# EAGLE design esp-module-su (EAGLE 9.6.2)
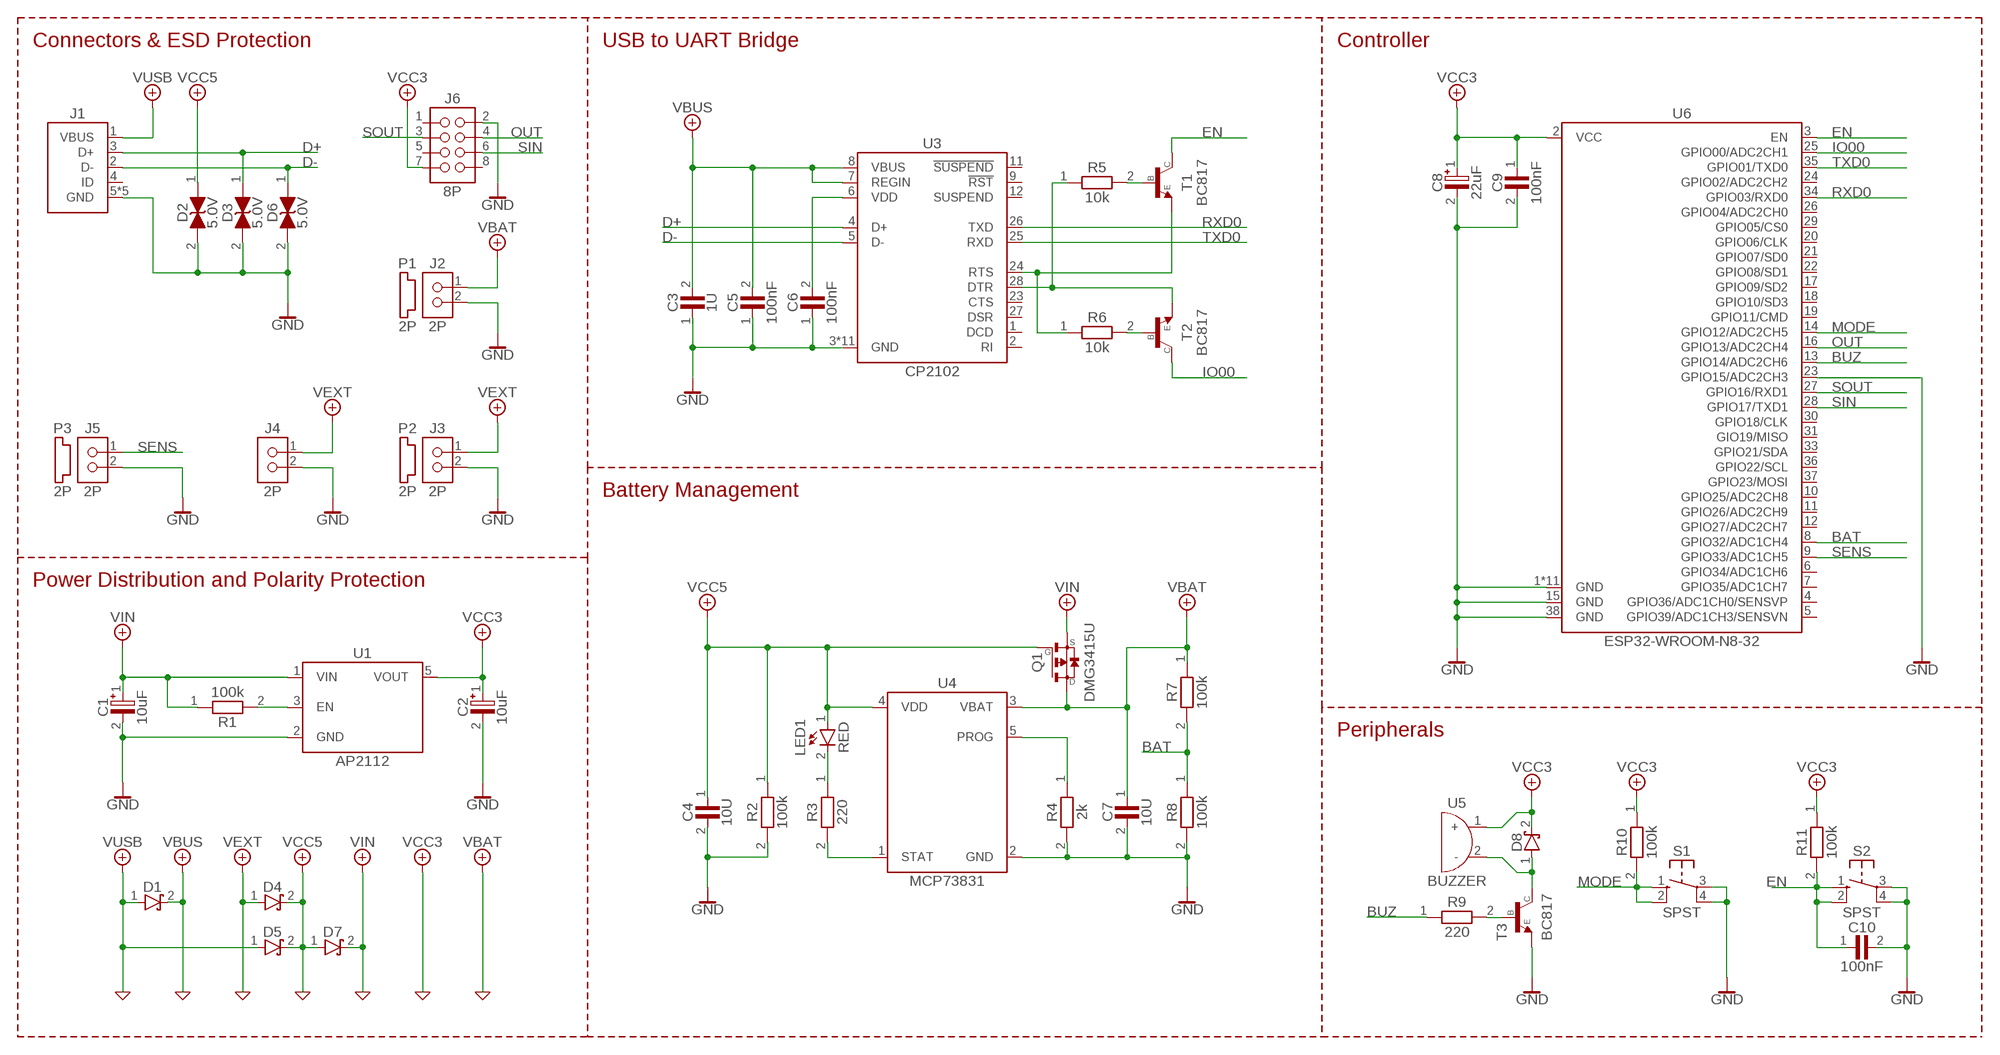
[diagram p0: schematic, sheet 1]

## Parts
C1  10uF  CAPACITOR-TANTALUM-10U-I1206-M3216  [I1206-M3216-D]
C2  10uF  CAPACITOR-TANTALUM-10U-I1206-M3216  [I1206-M3216-D]
C3  1U  CAPACITOR-CERAMIC-1U-I0805-M2012  [I0805-M2012-C]
C4  10U  CAPACITOR-CERAMIC-10U-I0805-M2012  [I0805-M2012-C]
C5  100nF  CAPACITOR-CERAMIC-100N-I0805-M2012  [I0805-M2012-C]
C6  100nF  CAPACITOR-CERAMIC-100N-I0805-M2012  [I0805-M2012-C]
C7  10U  CAPACITOR-CERAMIC-10U-I0805-M2012  [I0805-M2012-C]
C8  22uF  CAPACITOR-TANTALUM-22U-I1206-M3216  [I1206-M3216-D]
C9  100nF  CAPACITOR-CERAMIC-100N-I0805-M2012  [I0805-M2012-C]
C10  100nF  CAPACITOR-CERAMIC-100N-I0805-M2012  [I0805-M2012-C]
D1  30V  SCHOTTKY-30V-SOD-323  [SOD-323]
D2  5.0V  ZENER-BI-5.0V-SOD-523  [SOD-523]
D3  5.0V  ZENER-BI-5.0V-SOD-523  [SOD-523]
D4  30V  SCHOTTKY-30V-SOD-323  [SOD-323]
D5  30V  SCHOTTKY-30V-SOD-323  [SOD-323]
D6  5.0V  ZENER-BI-5.0V-SOD-523  [SOD-523]
D7  30V  SCHOTTKY-30V-SOD-323  [SOD-323]
D8  30V  SCHOTTKY-30V-SOD-323  [SOD-323]
J1  USB-A-MICRO-SMD-SIDE  [USB-A-MICRO-SMD-SIDE]
J2  2P  HEADER-02P-1R-S2B-PH-SM4-TB  [JST-S2B-PH-SM4-TB]
J3  2P  HEADER-02P-1R-S2B-PH-SM4-TB  [JST-S2B-PH-SM4-TB]
J4  2P  HEADER-02P-1R-PZ254V-11-02P  [PZ254V-11-02P]
J5  2P  HEADER-02P-1R-S2B-PH-SM4-TB  [JST-S2B-PH-SM4-TB]
J6  8P  HEADER-08P-2R-PM254V-12-08-H85  [PM254V-12-08-H85]
LED1  RED  LED-RED-I0805-M2012  [I0805-M2012-D]
P1  2P  CONNECTOR-02P-1R-PHR  [CONNECTOR-DEFAULT]
P2  2P  CONNECTOR-02P-1R-PHR  [CONNECTOR-DEFAULT]
P3  2P  CONNECTOR-02P-1R-PHR  [CONNECTOR-DEFAULT]
Q1  DMG3415U  MOSFET-P-CHANNEL-20V-4A-SOT-23-3  [SOT-23-3]
R1  100k  RESISTOR-100K-I0805-M2012  [I0805-M2012-R]
R2  100k  RESISTOR-100K-I0805-M2012  [I0805-M2012-R]
R3  220  RESISTOR-220-I0805-M2012  [I0805-M2012-R]
R4  2k  RESISTOR-2K-I0805-M2012  [I0805-M2012-R]
R5  10k  RESISTOR-10K-I0805-M2012  [I0805-M2012-R]
R6  10k  RESISTOR-10K-I0805-M2012  [I0805-M2012-R]
R7  100k  RESISTOR-100K-I0805-M2012  [I0805-M2012-R]
R8  100k  RESISTOR-100K-I0805-M2012  [I0805-M2012-R]
R9  220  RESISTOR-220-I0805-M2012  [I0805-M2012-R]
R10  100k  RESISTOR-100K-I0805-M2012  [I0805-M2012-R]
R11  100k  RESISTOR-100K-I0805-M2012  [I0805-M2012-R]
S1  SPST  SWITCH-12V-50MA  [SMD-SW-4]
S2  SPST  SWITCH-12V-50MA  [SMD-SW-4]
T1  BC817  TRANSISTOR-NPN-SOT-23-3  [SOT-23-3]
T2  BC817  TRANSISTOR-NPN-SOT-23-3  [SOT-23-3]
T3  BC817  TRANSISTOR-NPN-SOT-23-3  [SOT-23-3]
U1  AP2112  AP2112-SOT-25-5  [SOT-25-5]
U3  CP2102  CP2102-QFN-28  [QFN-28]
U4  MCP73831  MCP73831-SOT-23-5  [SOT-23-5]
U5  BUZZER  [SMD-BUZZER]
U6  ESP32-WROOM-N8-32  [ESP32-WROOM-32]

## Nets
ABEN: R1.2 U1.3(EN)
BAT: R7.2 R8.1 U6.8(GPIO32/ADC1CH4)
BUZ: R9.1 U6.13(GPIO14/ADC2CH6)
BZB: R9.2 T3.1(B)
BZC: D8.1(A) T3.3(C) U5.2(-)
D+: D3.1(A) J1.3(D+) U3.4(D+)
D-: D6.1(A) J1.2(D-) U3.5(D-)
DTR1: R5.1 T2.2(E) U3.28(DTR)
DTRT1: R5.2 T1.1(B)
EN: C10.1 R11.2 S2.1 S2.2 T1.3(C) U6.3(EN)
GND: C1.2(-) C2.2(-) C3.1 C4.2 C5.1 C6.1 C7.2 C8.2(-) C9.2 C10.2 D2.2(C) D3.2(C) D6.2(C) J1.5(GND) J1.6(GND) J1.7(GND) J1.8(GND) J1.9(GND) J2.2 J3.2 J4.2 J5.2 J6.2 R2.2 R4.2 R8.2 S1.3 S1.4 S2.3 S2.4 T3.2(E) U1.2(GND) U3.3(GND) U3.29(GND) U3.30(GND) U3.31(GND) U3.32(GND) U3.33(GND) U3.34(GND) U3.35(GND) U3.36(GND) U3.37(GND) U3.38(GND) U4.2(GND) U6.1(GND) U6.15(GND) U6.23(GPIO15/ADC2CH3) U6.38(GND) U6.39(GND) U6.40(GND) U6.41(GND) U6.42(GND) U6.43(GND) U6.44(GND) U6.45(GND) U6.46(GND) U6.47(GND) U6.48(GND)
IO00: T2.3(C) U6.25(GPIO00/ADC2CH1)
MODE: R10.2 S1.1 S1.2 U6.14(GPIO12/ADC2CH5)
OUT: J6.4 U6.16(GPIO13/ADC2CH4)
PROG1: R4.1 U4.5(PROG)
RTS1: R6.1 T1.2(E) U3.24(RTS)
RTST1: R6.2 T2.1(B)
RXD0: U3.26(TXD) U6.34(GPIO03/RXD0)
SENS: J5.1 U6.9(GPIO33/ADC1CH5)
SIN: J6.6 U6.28(GPIO17/TXD1)
SOUT: J6.3 U6.27(GPIO16/RXD1)
STAT1: R3.2 U4.1(STAT)
STATLED1: LED1.2(C) R3.1
TXD0: U3.25(RXD) U6.35(GPIO01/TXD0)
VBAT: C7.1 J2.1 Q1.3(D) R7.1 U4.3(VBAT)
VBUS: C3.2 C5.2 D1.2(C) U3.7(REGIN) U3.8(VBUS)
VCC3: C2.1(+) C8.1(+) C9.1 D8.2(C) J6.7 R10.1 R11.1 U1.5(VOUT) U5.1(+) U6.2(VCC)
VCC5: C4.1 D2.1(A) D4.2(C) D5.2(C) D7.1(A) LED1.1(A) Q1.1(G) R2.1 U4.4(VDD)
VDD: C6.2 U3.6(VDD)
VEXT: D4.1(A) J3.1 J4.1
VIN: C1.1(+) D7.2(C) Q1.2(S) R1.1 U1.1(VIN)
VUSB: D1.1(A) D5.1(A) J1.1(VBUS)
Unconnected: J1.4(ID) J6.1 J6.5 J6.8 U3.1(DCD) U3.2(RI) U3.9(!RST) U3.11(!SUSPEND) U3.12(SUSPEND) U3.23(CTS) U3.27(DSR) U6.4(GPIO36/ADC1CH0/SENSVP) U6.5(GPIO39/ADC1CH3/SENSVN) U6.6(GPIO34/ADC1CH6) U6.7(GPIO35/ADC1CH7) U6.10(GPIO25/ADC2CH8) U6.11(GPIO26/ADC2CH9) U6.12(GPIO27/ADC2CH7) U6.17(GPIO09/SD2) U6.18(GPIO10/SD3) U6.19(GPIO11/CMD) U6.20(GPIO06/CLK) U6.21(GPIO07/SD0) U6.22(GPIO08/SD1) U6.24(GPIO02/ADC2CH2) U6.26(GPIO04/ADC2CH0) U6.29(GPIO05/CS0) U6.30(GPIO18/CLK) U6.31(GIO19/MISO) U6.33(GPIO21/SDA) U6.36(GPIO22/SCL) U6.37(GPIO23/MOSI)

## Notes on the sheet
- Connectors & ESD Protection | USB to UART Bridge | Controller
- Battery Management
- Power Distribution and Polarity Protection
- Peripherals

## Library data of the parts
C1 C2 = deiring-components:CAPACITOR-TANTALUM: Capacitors Tantalum; LCSC: C7171; MF: Kyocera AVX; MPN: TAJA106K016RNJ; VOLTAGE: 16V
C3 = deiring-components:CAPACITOR-CERAMIC: Capacitors Multilayer Ceramic; LCSC: C215803; MF: FH (Guangdong Fenghua Advanced Tech); MPN: 0805B105K500NT; TOLERANCE: 10%; VOLTAGE: 50V
C4 C7 = deiring-components:CAPACITOR-CERAMIC: Capacitors Multilayer Ceramic; LCSC: C15850; MF: Samsung Electro-Mechanics; MPN: CL21A106KAYNNNE; TOLERANCE: 10%; VOLTAGE: 25V
C5 C6 C9 C10 = deiring-components:CAPACITOR-CERAMIC: Capacitors Multilayer Ceramic; LCSC: C38141; MF: FH (Guangdong Fenghua Advanced Tech); MPN: 0805B104K500NT; TOLERANCE: 10%; VOLTAGE: 50V
C8 = deiring-components:CAPACITOR-TANTALUM: Capacitors Tantalum; LCSC: C11366; MF: Kyocera AVX; MPN: TAJA226K010RNJ; VOLTAGE: 10V
D1 D4 D5 D7 D8 = deiring-components:SCHOTTKY: Shottky Barrier Diodes; LCSC: C124187; MF: Diodes Incorporated; MPN: BAT760-7
D2 D3 D6 = deiring-components:ZENER-BI: Zener Diode; LCSC: C383211; MF: LRC; MPN: LESD5D5.0CT1G
J1 = deiring-components:USB-A: USB Micro-B Connector; LCSC: C381143; MF: XKB Connectivity; MPN: U254-051T-4BHJ25-F2S
J2 J3 J5 = deiring-components:HEADER-02P-1R: Header 2 Pin 1 Row; LCSC: C295747; MF: JST Sales America; MPN: S2B-PH-SM4-TB(LF)(SN)
J4 = deiring-components:HEADER-02P-1R: Header 2 Pin 1 Row; LCSC: C492401; MF: XFCN; MPN: PZ254V-11-02P
J6 = deiring-components:HEADER-08P-2R: Header 8 Pin 2 Row; LCSC: C2834799; MF: XFCN; MPN: PM254V-12-08-H85
LED1 = deiring-components:LED: Light Emitting Diodes; LCSC: C84256; MF: Foshan NationStar Optoelectronics; MPN: FC-2012HRK-620D
P1-P3 = deiring-components:CONNECTOR-02P-1R: Plug 2 Pin 1 Row; LCSC: C3195190; MF: JST Sales America; MPN: PHR-2
Q1 = deiring-components:MOSFET-P-CHANNEL: P-Channel MOSFET; CURRENT: 4A; LCSC: C96616; MF: Diodes Incorporated; MPN: DMG3415U-7; VOLTAGE: 20V
R1 R2 R7 R8 R10 R11 = deiring-components:RESISTOR: Chip Resistor; LCSC: C149504; MF: UNI-ROYAL(Uniroyal Elec); MPN: 0805W8F1003T5E; WATTAGE: 1/8W
R3 R9 = deiring-components:RESISTOR: Chip Resistor; LCSC: C17557; MF: UNI-ROYAL(Uniroyal Elec); MPN: 0805W8F2200T5E; WATTAGE: 1/8W
R4 = deiring-components:RESISTOR: Chip Resistor; LCSC: C17604; MF: UNI-ROYAL(Uniroyal Elec); MPN: 0805W8F2001T5E; WATTAGE: 1/8W
R5 R6 = deiring-components:RESISTOR: Chip Resistor; LCSC: C17414; MF: UNI-ROYAL(Uniroyal Elec); MPN: 0805W8F1002T5E; WATTAGE: 1/8W
S1 S2 = deiring-components:SWITCH: Tactile Switch SPST; LCSC: C318884; MF: XKB Enterprise; MPN: TS-1187A-B-A-B; VOLTAGE: 12V
T1-T3 = deiring-components:TRANSISTOR-NPN: NPN General-Ourpose Transistors; LCSC: C52801; MF: Nexperia; MPN: BC817-40,215
U1 = deiring-components:AP2112: Linear Voltage Regulators; LCSC: C3021085; MF: TECH PUBLIC; MPN: TPAP2112K-3.3TRG1
U3 = deiring-components:CP2102: Single-Chip USB to UART Bridge; LCSC: C6568; MF: SILICON LABS; MPN: CP2102-GMR
U4 = deiring-components:MCP73831: Miniature Single-Cell, Fully Integrated Li-Ion, Li-Polymer Charge Management Controllers; LCSC: C14879; MF: Microchip Tech; MPN: MCP73831T-2ATI/OT
U5 = deiring-components:BUZZER: Externally Driven Buzzer; LCSC: C95299; MF: MLT-7525; MPN: Jiangsu Huaneng Elec
U6 = deiring-components:ESP32-WROOM: ESP WROOM 32; LCSC: C529582; MF: Espressif Systems; MPN: ESP32-WROOM-32-N8; VALUES: ESP32

## Board
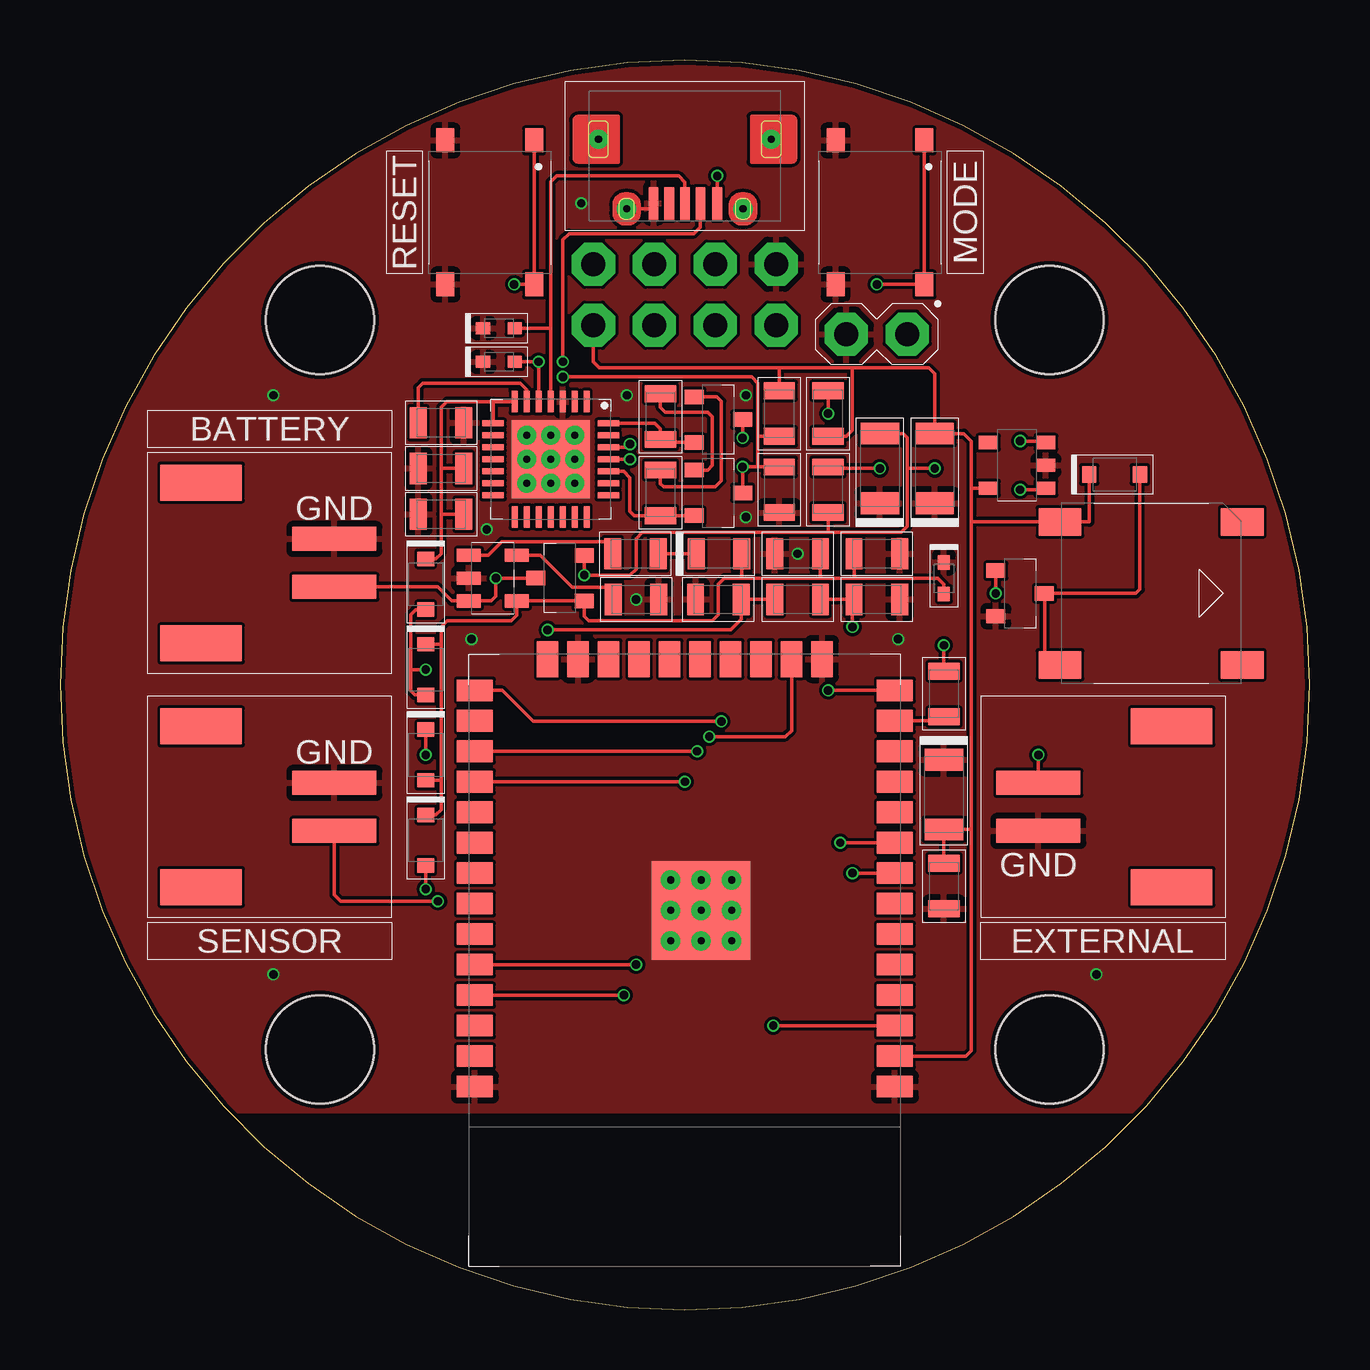
[diagram p1: board, top side]
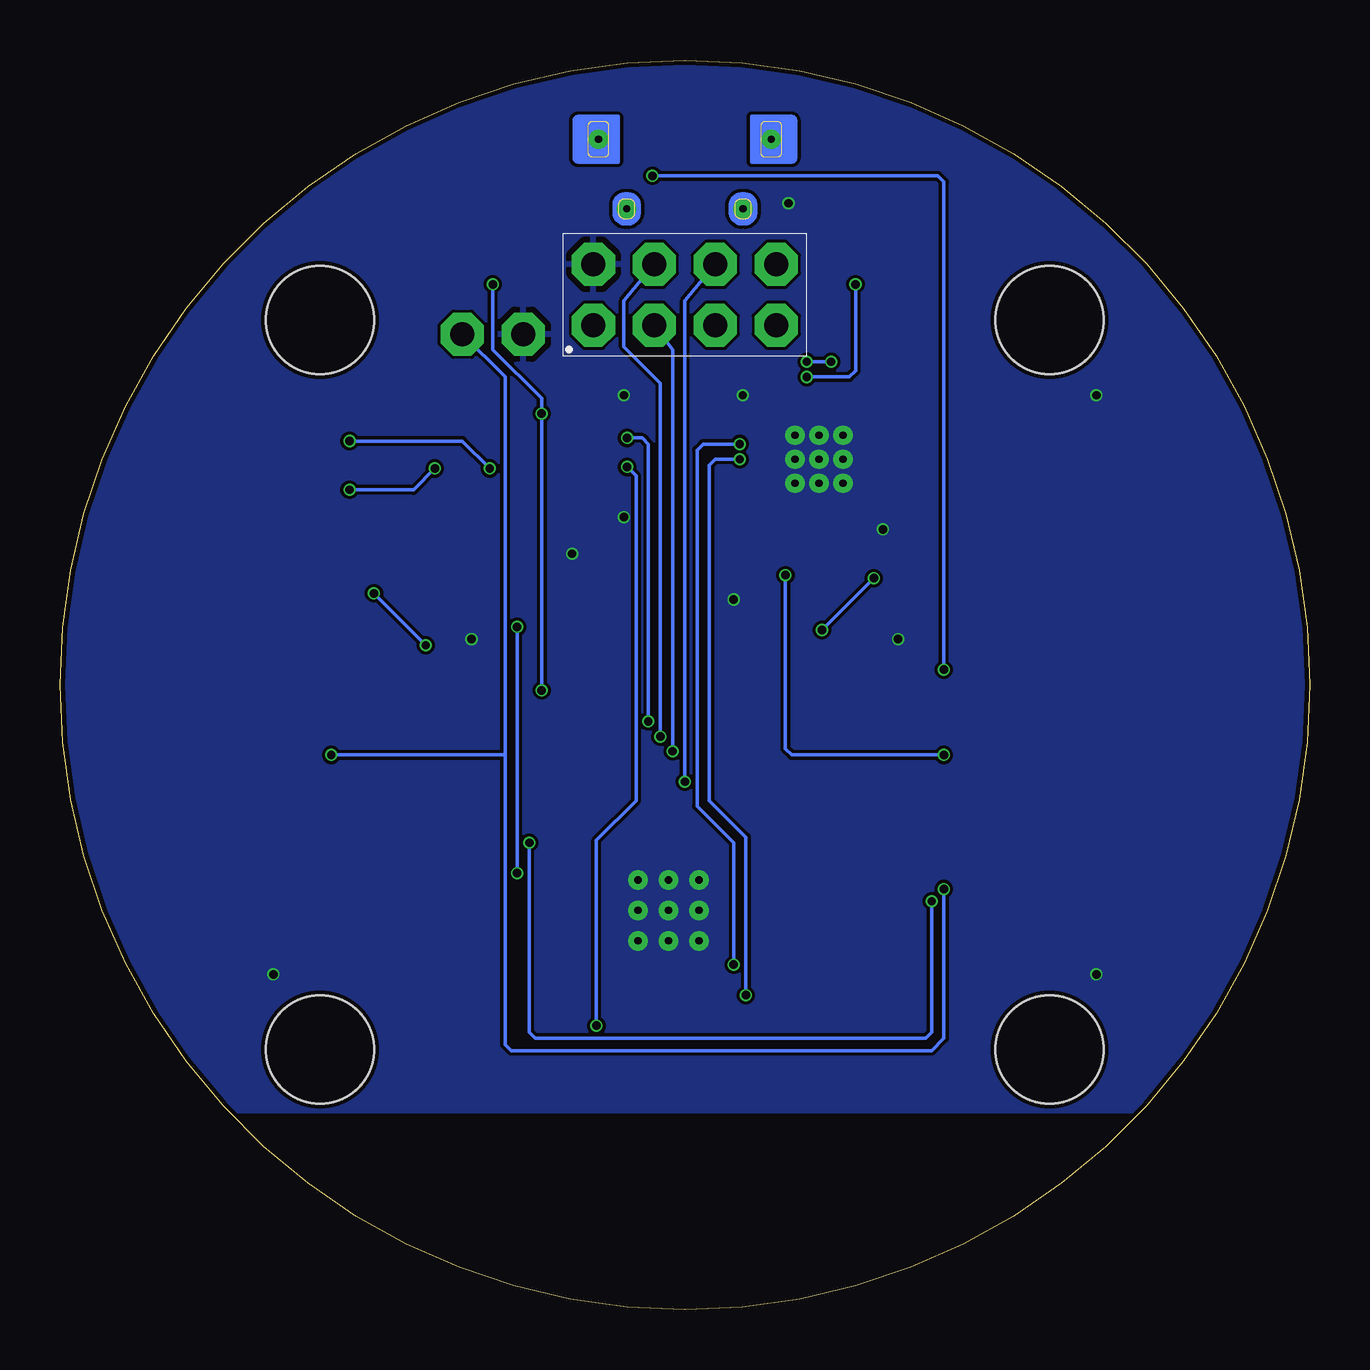
[diagram p2: board, bottom side, seen from below]

Size 52.07 x 52.07 mm. Coordinates in mm from the lower left corner, seen from the top.
Outline: 52.07,26.04 arc90 26.04,52.07 arc90 0,26.04 arc90 26.04,0 arc90 52.07,26.04
Copper layers (1*16): Top 0.035mm / dielectric 1.6mm / Bottom 0.035mm
Design rules "jlcpcb-2layers": minimum track width 5mil, minimum drill 0.3mm, track to track 5mil, track to pad 5mil, pad to pad 5mil, via to via 5mil, smd to smd 5mil, copper to edge 0.2mm, drill to drill 6mil, minimum pad ring 10mil, minimum via ring 3mil, stop-mask expansion 4mil, vias tented up to drill 0mil, thermal gap 10mil
Holes 4.5 mm at 41.23,41.23 10.84,41.23 10.84,10.84 41.23,10.84

### Footprints (pad centres in the part's own frame; a part is rotated, then mirrored left to right if it is on the bottom)
I1206-M3216-D = smd 0.9 x 1.6: 1 -1.45,0; 2 1.45,0
I0805-M2012-C = smd 0.7 x 1.3: 1 -0.95,0; 2 0.95,0
SOD-323 = smd 0.6 x 0.7: 1 -1.055,0; 2 1.055,0
SOD-523 = smd 0.6 x 0.5: 1 -0.66,0; 2 0.66,0
USB-A-MICRO-SMD-SIDE = smd 0.4 x 1.35: 1 -1.35,2.675; 2 -0.65,2.675; 3 0,2.675; 4 0.65,2.675; 5 1.3,2.675 | drill 0.3 pad 0.6: 6 -2.425,2.9; 7 2.425,2.9 | drill 0.3: 8 -3.6,0; 9 3.6,0
JST-S2B-PH-SM4-TB = smd 1 x 3.5: 1 -1,0; 2 1,0 | smd 1.5 x 3.4: A -3.35,5.55; B 3.35,5.55
PZ254V-11-02P = drill 1 pad 1.7 octagon: 1 -1.27,0; 2 1.27,0
PM254V-12-08-H85 = drill 1 pad 1.7 octagon: 1 -3.81,-1.27; 2 -3.81,1.27; 3 -1.27,-1.27; 4 -1.27,1.27; 5 1.27,-1.27; 6 1.27,1.27; 7 3.81,-1.27; 8 3.81,1.27
I0805-M2012-D = smd 0.7 x 1.3: 1 -0.95,0; 2 0.95,0
SOT-23-3 = smd 0.8 x 0.6: 1 1.01,-0.95; 2 1.01,0.95; 3 -1.01,0
I0805-M2012-R = smd 0.7 x 1.3: 1 -0.95,0; 2 0.95,0
SMD-SW-4 = smd 1 x 0.75: 1 -3,1.85; 2 3,1.85; 3 -3,-1.85; 4 3,-1.85
SOT-25-5 = smd 0.55 x 0.8: 1 0.95,1.2; 2 0,1.2; 3 -0.95,1.2; 4 -0.95,-1.2; 5 0.95,-1.2
QFN-28 = smd 0.9 x 0.25: 1 -2.4,1.5; 2 -2.4,1; 3 -2.4,0.5; 4 -2.4,0; 5 -2.4,-0.5; 6 -2.4,-1; 7 -2.4,-1.5; 15 2.4,-1.5; 16 2.4,-1; 17 2.4,-0.5; 18 2.4,0; 19 2.4,0.5; 20 2.4,1; 21 2.4,1.5 | smd 0.25 x 0.9: 8 -1.5,-2.4; 9 -1,-2.4; 10 -0.5,-2.4; 11 0,-2.4; 12 0.5,-2.4; 13 1,-2.4; 14 1.5,-2.4; 22 1.5,2.4; 23 1,2.4; 24 0.5,2.4; 25 0,2.4; 26 -0.5,2.4; 27 -1,2.4; 28 -1.5,2.4 | smd 3.25 x 3.25: 29 0,0 | drill 0.3 pad 0.5: 30 -1,1; 31 0,1; 32 1,1; 33 -1,0; 34 0,0; 35 1,0; 36 -1,-1; 37 0,-1; 38 1,-1
SOT-23-5 = smd 1 x 0.55: 1 -1,0.95; 2 -1,0; 3 -1,-0.95; 4 1,-0.95; 5 1,0.95
SMD-BUZZER = smd 1.78 x 1.15: 1 -3.795,2.98; 2 -3.795,-2.98; 3 3.795,-2.98; 4 3.795,2.98
ESP32-WROOM-32 = smd 1.5 x 0.9: 1 -8.75,7.34; 2 -8.75,6.07; 3 -8.75,4.8; 4 -8.75,3.53; 5 -8.75,2.26; 6 -8.75,0.99; 7 -8.75,-0.28; 8 -8.75,-1.55; 9 -8.75,-2.82; 10 -8.75,-4.09; 11 -8.75,-5.36; 12 -8.75,-6.63; 13 -8.75,-7.9; 14 -8.75,-9.17; 25 8.75,-9.17; 26 8.75,-7.9; 27 8.75,-6.63; 28 8.75,-5.36; 29 8.75,-4.09; 30 8.75,-2.82; 31 8.75,-1.55; 32 8.75,-0.28; 33 8.75,0.99; 34 8.75,2.26; 35 8.75,3.53; 36 8.75,4.8; 37 8.75,6.07; 38 8.75,7.34 | smd 0.9 x 1.5: 15 -5.715,-10.47; 16 -4.445,-10.47; 17 -3.175,-10.47; 18 -1.905,-10.47; 19 -0.635,-10.47; 20 0.635,-10.47; 21 1.905,-10.47; 22 3.175,-10.47; 23 4.445,-10.47; 24 5.715,-10.47 | smd 4.1 x 4.1: 39 -0.68,0 | drill 0.3 pad 0.5: 40 0.59,-1.27; 41 -0.68,-1.27; 42 -1.95,-1.27; 43 0.59,0; 44 -0.68,0; 45 -1.95,0; 46 0.59,1.27; 47 -0.68,1.27; 48 -1.95,1.27

### Placement (x,y rotation side)
C1  34.16,35.05 270 top
C2  36.45,35.05 270 top
C3  15.88,35.05 0 top
C4  30.73,31.5 180 top
C5  15.88,33.15 0 top
C6  15.88,36.96 180 top
C7  27.43,29.59 180 top
C8  36.83,21.46 90 top
C9  36.83,17.65 270 top
C10  29.97,34.16 270 top
D1  15.24,30.23 90 top
D2  36.83,30.48 90 top
D3  18.29,40.89 180 top
D4  15.24,19.56 90 top
D5  15.24,26.67 90 top
D6  18.29,39.5 180 top
D7  15.24,23.11 90 top
D8  43.94,34.8 180 top
J1  26.04,48.77 180 top
J2  11.43,31.11 90 top
J3  40.77,20.95 270 top
J4  34.04,40.64 180 top
J5  11.43,20.95 90 top
J6  26.04,42.29 0 bottom
LED1  27.46,31.5 180 top
P1  6.48,31.11 90 top
P2  45.34,20.95 90 top
P3  6.48,20.95 90 top
Q1  20.83,30.48 0 top
R1  32,34.16 90 top
R2  34.04,31.5 0 top
R3  23.98,31.5 180 top
R4  24,29.59 0 top
R5  25.02,37.21 90 top
R6  25.02,34.04 90 top
R7  30.73,29.59 0 top
R8  34.04,29.59 0 top
R9  36.83,25.65 90 top
R10  32,37.34 90 top
R11  29.97,37.34 270 top
S1  34.16,45.72 270 top
S2  17.91,45.72 270 top
T1  27.43,34.04 180 top
T2  27.43,37.08 180 top
T3  40.01,29.84 180 top
U1  39.88,35.18 270 top
U3  20.45,35.43 270 top
U4  18.03,30.48 0 top
U5  45.47,29.84 0 top
U6  26.04,16.64 180 top

### Tracks (layer width: path | path; a pad name or v marks a point on that pad's centre or on a via)
ABEN  (via drill 0.35)
  Top 0.152: v34.16,35.05 32,35.05 R1.2 | v40.01,36.2 41.08,36.2 U1.3
  Bottom 0.152: v34.16,35.05 35.31,36.2 v40.01,36.2
BAT  (via drill 0.35)
  Top 0.152: R7.2 R8.1 33.02,29.59 v33.02,28.45 | v33.02,18.19 U6.8
  Bottom 0.152: v33.02,18.19 v33.02,28.45
BUZ
  Top 0.152: U6.13 36.83,24.54 R9.1
BZB  (via drill 0.35)
  Top 0.152: T3.1 v38.99,29.84 | R9.2 v36.83,27.69
  Bottom 0.152: v36.83,27.69 v38.99,29.84
BZC
  Top 0.152: T3.3 | T3.3 44.83,29.84 45,30.01 D8.1 | U5.2 41.02,26.86 T3.3
D+
  Top 0.152: J1.3 26.04,46.98 25.77,47.24 20.7,47.24 20.45,46.99 20.45,40.89 | U3.4 20.45,40.89 | 20.45,40.89 D3.1
D-  (via drill 0.35)
  Top 0.152: U3.5 v19.95,39.5 v19.94,39.5 D6.1 | v20.95,39.5 20.95,44.58 21.21,44.83 26.42,44.83 26.68,45.1 J1.2
  Bottom 0.152: v19.94,39.5 v20.95,39.5
DTR1
  Top 0.152: U3.28 24.79,36.93 25.02,36.7 R5.1 25.02,36.13 T2.2
DTRT1
  Top 0.152: R5.2 25.02,37.59 25.21,37.4 26.99,37.4 27.18,37.21 27.18,35.18 26.98,34.99 T1.1
EN  (via drill 0.35)
  Top 0.152: S2.1 S2.2 v18.92,42.72 | U6.3 v29.72,11.84 | 29.08,35.11 v28.44,35.11 T1.3 | 29.08,35.11 C10.1 | v20.95,38.86 28.83,38.86 29.08,38.61 29.08,36.58 29.08,36.39 | 29.08,36.39 29.08,35.11 | R11.2 29.08,36.39
  Bottom 0.152: v29.72,11.84 29.72,19.56 28.07,21.21 28.07,34.74 v28.44,35.11 | v20.95,38.86 19.18,38.86 18.92,39.12 v18.92,42.72
GND  (via drill 0.35)
  Top 0.152: J1.7 24.73,45.87 J1.5
  other vias: 24,29.59 34.92,27.94 30.73,31.5 8.89,38.1 43.18,13.97 8.89,13.97 17.14,27.94 28.57,33.02 28.57,38.1 23.62,38.1 17.78,32.51 21.72,46.1
  pour Top (isolate 0.076): -1.27,8.26 53.34,8.26 53.34,53.34 -1.27,53.34
  pour Bottom: -2.54,8.26 54.61,8.26 54.61,54.61 -2.54,54.61
IO00  (via drill 0.35)
  Top 0.152: U6.25 18.43,25.81 19.72,24.51 v27.56,24.51 | T2.3 v28.44,36.32
  Bottom 0.152: v27.56,24.51 27.56,36.07 27.81,36.32 v28.44,36.32
MODE  (via drill 0.35)
  Top 0.152: S1.1 S1.2 v34.04,42.72 | v32,25.81 U6.14 | R10.2 v32,37.34
  Bottom 0.152: v32,25.81 v32,37.34 32,37.97 34.04,40.01 v34.04,42.72
OUT  (via drill 0.35)
  Top 0.152: v27.05,23.88 30.23,23.88 30.48,24.13 U6.16
  Bottom 0.152: v27.05,23.88 27.05,38.61 28.57,40.13 28.57,42.04 J6.4
PROG1
  Top 0.152: U4.5 20,31.43 21.34,30.1 23.05,30.1 R4.1
RTS1
  Top 0.152: T1.2 R6.1 23.94,33.09 23.75,33.27 23.75,34.67 23.49,34.93 U3.24
RTST1
  Top 0.152: R6.2 25.02,34.42 25.15,34.29 27.3,34.29 27.56,34.54 27.56,37.85 27.37,38.03 T2.1
RXD0  (via drill 0.35)
  Top 0.152: U6.34 v24,14.38 | U3.26 23.61,35.93 v23.75,36.07
  Bottom 0.152: v23.75,36.07 25.27,36.07 25.53,35.81 25.53,20.98 24,19.46 v24,14.38
SENS  (via drill 0.35)
  Top 0.152: v15.75,17.02 11.7,17.02 11.43,17.29 J5.1 | v32.51,19.46 U6.9
  Bottom 0.152: v32.51,19.46 32.51,11.56 32.26,11.3 16,11.3 15.75,11.56 v15.75,17.02
SIN  (via drill 0.35)
  Top 0.152: v26.04,22 U6.28
  Bottom 0.152: J6.6 26.04,42.04 v26.04,22
SOUT  (via drill 0.35)
  Top 0.152: v26.54,23.27 U6.27
  Bottom 0.152: J6.3 26.54,40.01 v26.54,23.27
STAT1
  Top 0.152: U4.1 17.84,31.43 18.41,32 23.03,32 R3.2
STATLED1
  Top 0.152: R3.1 LED1.2
TXD0  (via drill 0.35)
  Top 0.152: U6.35 v23.5,13.11 | U3.25 v23.75,35.43
  Bottom 0.152: v23.75,35.43 24.77,35.43 25.02,35.18 25.02,21.21 23.5,19.68 v23.5,13.11
VBAT  (via drill 0.35)
  Top 0.152: J2.1 15.73,30.11 16.32,29.53 U4.3 17.97,29.53 18.16,29.72 v18.16,30.48 Q1.3 | R7.1 C7.1 28.38,28.76 27.94,28.32 v20.32,28.32
  Bottom 0.152: v20.32,28.32 v18.16,30.48
VBUS
  Top 0.152: U3.8 18.05,37.83 | 18.05,37.83 U3.7 | 18.05,37.83 16.12,37.83 15.88,37.59 15.88,35.05 | 15.88,35.05 C3.2 | 15.88,35.05 15.88,33.15 | 15.88,33.15 15.88,31.5 15.66,31.28 D1.2 | 15.88,33.15 C5.2
VCC3
  Top 0.152: C9.1 C8.1 37.97,20.01 | J6.7 22.23,39.5 22.48,39.24 29.97,39.24 | U6.2 34.8,10.57 37.74,10.57 37.97,10.79 37.97,20.01 | 33.02,39.24 36.2,39.24 36.45,38.99 C2.1 37.67,36.5 37.97,36.2 37.97,34.23 | 29.97,39.24 33.02,39.24 | R11.1 29.97,39.24 | 37.97,34.23 37.97,32.83 | R10.1 32.77,36.39 33.02,36.64 33.02,39.24 | 37.97,32.83 37.97,20.01 | U1.5 37.97,34.23 | 37.97,32.83 U5.1 42.89,32.83 D8.2
VCC5
  Top 0.152: D5.2 15.88,27.73 | D7.1 15.88,22.06 | 15.88,22.06 15.88,20.83 15.66,20.61 D4.2 | LED1.1 28.41,30.48 | C4.1 31.68,30.48 | 28.41,30.48 31.68,30.48 | 33.09,30.48 R2.1 | 28.41,30.48 27.69,30.48 27.43,30.23 27.43,28.96 27.18,28.7 22.03,28.7 21.84,28.89 Q1.1 U4.4 19.03,28.94 18.8,28.7 16.13,28.7 15.88,28.45 15.88,27.73 | 15.88,22.06 15.88,27.73 | 31.68,30.48 33.09,30.48 | 33.09,30.48 36.58,30.48 36.83,30.23 D2.1
VDD
  Top 0.152: U3.6 19.45,38.34 19.18,38.61 15.11,38.61 14.93,38.42 C6.2
VEXT  (via drill 0.35)
  Top 0.152: D4.1 v15.24,17.53 | J3.1 v40.77,23.11
  Bottom 0.152: 33.53,23.11 33.53,11.05 33.27,10.79 15.75,10.79 15.24,11.3 v15.24,17.53 | 33.53,23.11 33.53,38.86 J4.1 | v40.77,23.11 33.53,23.11
VIN  (via drill 0.35)
  Top 0.152: Q1.2 v21.84,30.61 23.75,30.61 24,30.86 24,32.13 24.26,32.38 32,32.38 | D7.2 v15.24,23.11 | R1.1 32,32.38 | 32,32.38 35.05,32.38 35.31,32.64 35.31,35.05 | 35.31,35.05 35.31,36.32 35.13,36.5 C1.1 | v36.45,35.05 35.31,35.05 | v40.01,34.16 41.08,34.16 U1.1
  Bottom 0.152: v21.84,30.61 21.84,23.37 21.59,23.11 v15.24,23.11 | v36.45,35.05 37.34,34.16 v40.01,34.16
VUSB  (via drill 0.35)
  Top 0.152: D1.1 14.82,29.17 14.61,28.96 14.61,26.67 | D5.1 14.77,25.61 14.61,25.78 14.61,26.67 | v15.24,26.67 14.61,26.67 | v27.39,47.24 J1.1
  Bottom 0.152: v15.24,26.67 15.24,46.99 15.49,47.24 v27.39,47.24

### Text on the board
tNames: RESET | MODE | BATTERY | GND | GND | GND | SENSOR | EXTERNAL